# Altium schematic sheet POWER.SchDoc: Air724UG 参考设计
size 594 x 419 mm; DESIGNER: Loukanghua; REV: V1.0
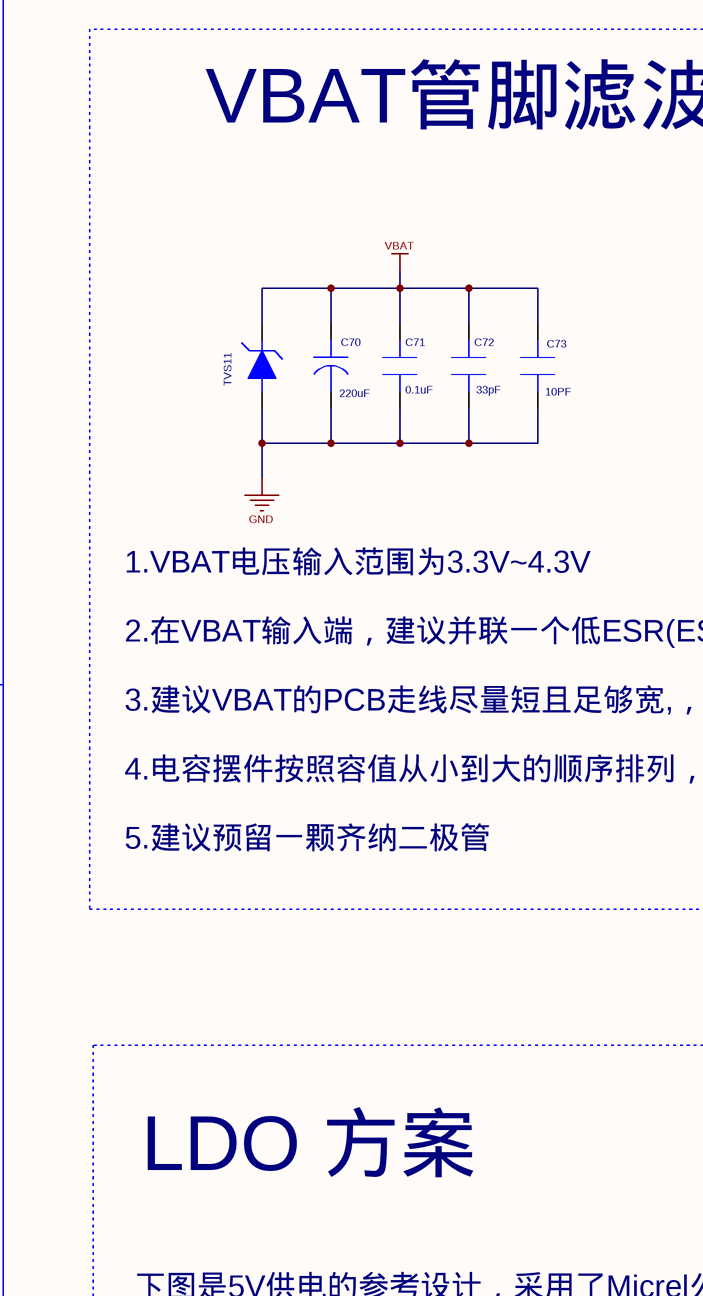
[diagram p0: POWER.SchDoc, top left]
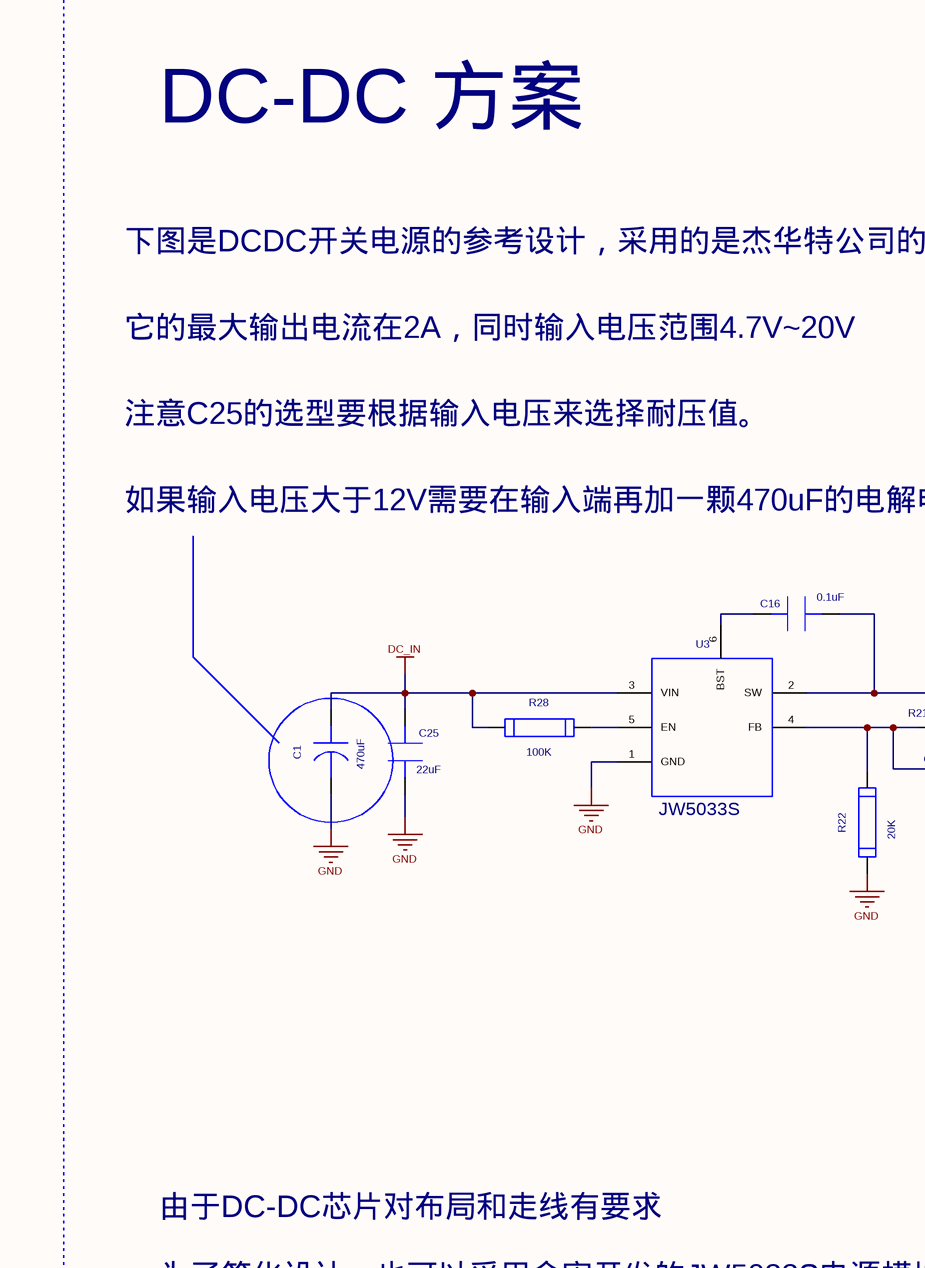
[diagram p1: POWER.SchDoc, top middle]
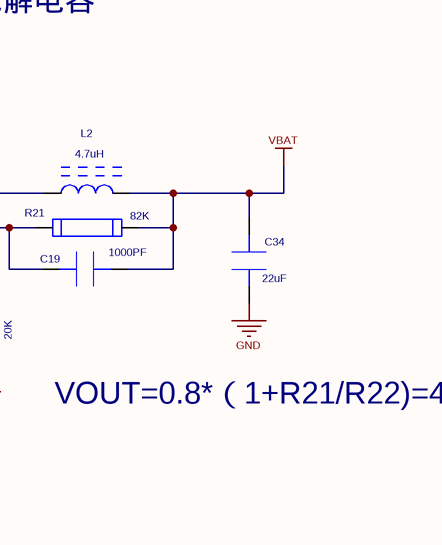
[diagram p2: POWER.SchDoc, top right]
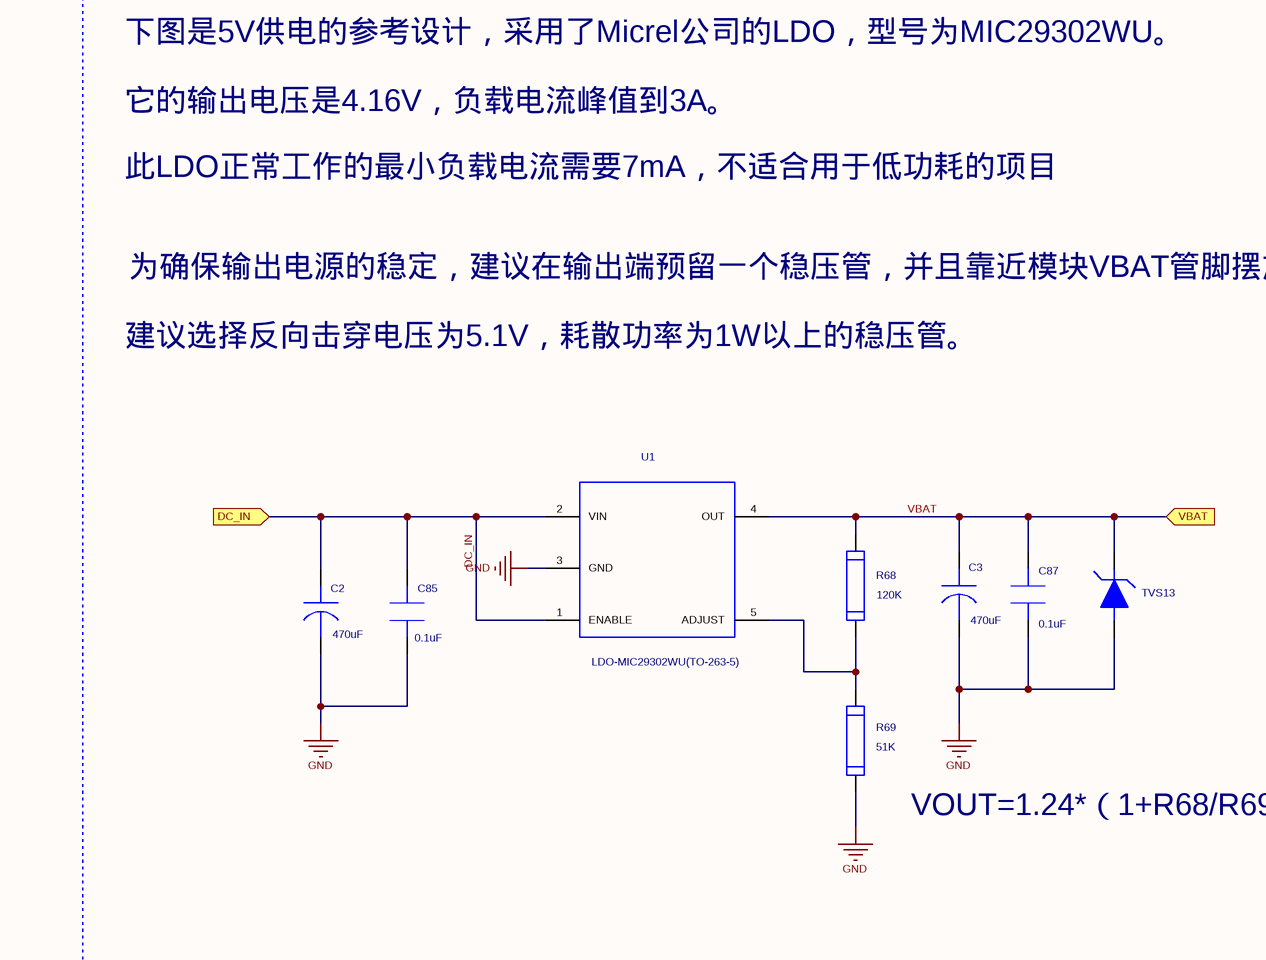
[diagram p3: POWER.SchDoc, bottom left]
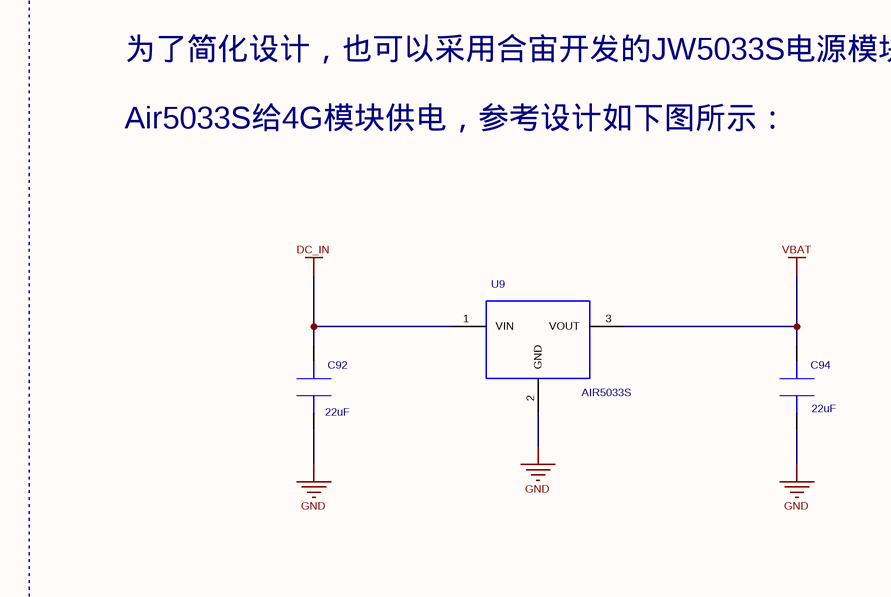
[diagram p4: POWER.SchDoc, bottom middle]
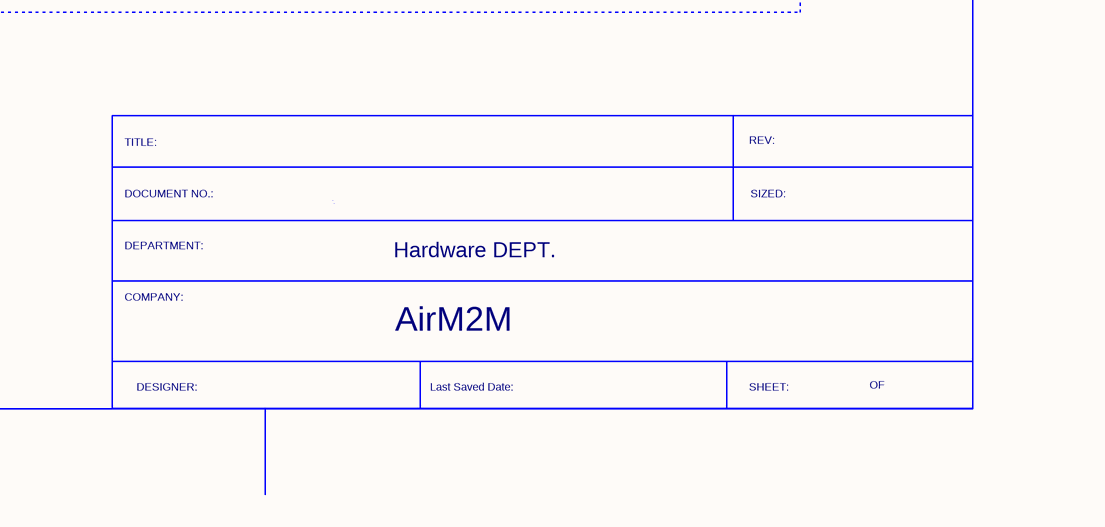
[diagram p5: POWER.SchDoc, bottom right]

## Parts
C1  value 470uF  [CAP-PD-8MMX11.5MM-UVR1C471MPD]  (hidden comment: CAP-AL-470UF-16V-8X11.5MM)
C2  value 470uF  [CAP-PD-8MMX11.5MM-UVR1C471MPD]  (hidden comment: CAP-AL-470UF-16V-8X11.5MM)
C3  value 470uF  [CAP-PD-8MMX11.5MM-UVR1C471MPD]  (hidden comment: CAP-AL-470UF-16V-8X11.5MM)
C16  value 0.1uF  [SC0402]  (hidden comment: CAP-0.1UF-0402-X5R-10V)
C19  value 1000PF  [SC0402]  (hidden comment: CAP-1000PF-0402-X7R)
C25  value 22uF  [SC0603]  (hidden comment: CAP-22UF-0603-X5R)
C34  value 22uF  [SC0603]  (hidden comment: CAP-4.7UF-0603-X5R)
C70  value 220uF  [CASEB]  (hidden comment: CAP-TAN-100UF-CASEB)
C71  value 0.1uF  [SC0402]  (hidden comment: CAP-0.1UF-0402-X7R)
C72  value 33pF  [SC0402]  (hidden comment: CAP-33PF-0402-C0G)
C73  value 10PF  [SC0402]  (hidden comment: CAP-10PF-0402-C0G)
C85  value 0.1uF  [SC0402]  (hidden comment: CAP-0.1UF-0402-X7R)
C87  value 0.1uF  [SC0402]  (hidden comment: CAP-0.1UF-0402-X7R)
C92  value 22uF  [SC0805]  (hidden comment: CAP-22UF-0805-X5R)
C94  value 22uF  [SC0805]  (hidden comment: CAP-22UF-0805-X5R)
L2  value 4.7uH  [MRSC252A12-4R7W-N]  (hidden comment: MRSC252A12-4R7W-N)
R21  value 82K  [SR0402]  (hidden comment: RES-82K-+-1%-0402)
R22  value 20K  [SR0402]  (hidden comment: RES-20K-+/-1%-0402)
R28  value 100K  [SR0402]  (hidden comment: RES-100K-0402)
R68  value 120K  [SR0402]  (hidden comment: RES-120K-+-1%-0402)
R69  value 51K  [SR0402]  (hidden comment: RES-51K-0402)
TVS11  ESD-TVS-PESDU4581P1H  [DFN1006]  (value not drawn)
TVS13  ESD-TVS-PESDU4581P1H  [DFN1006]  (value not drawn)
U1  LDO-MIC29302WU(TO-263-5)  [TO-263-5L]
U3  JW5033H  [JW5033S]  (value not drawn)
U9  AIR5033S  [A5033S]

## Blocks framed on the sheet
VBAT管脚滤波电容: C70-C73 TVS11
DC-DC 方案: C1 C16 C19 C25 C34 C92 C94 L2 R21 R22 R28 U3 U9
LDO 方案: C2 C3 C85 C87 R68 R69 TVS13 U1

## Ports
DC_IN, VBAT

## Nets
DC_IN: C1.1 C2.1 C25.2 C85.1 C92.2 R28.1 U1.1(ENABLE) U1.2(VIN) U3.3(VIN) U9.1(VIN) ; port DC_IN
GND: C1.2 C2.2 C3.2 C25.1 C34.1 C70.2 C71.2 C72.2 C73.2 C85.2 C87.2 C92.1 C94.1 R22.1 R69.1 TVS11.2 TVS13.2 U1.3(GND) U1.6(GND) U3.1(GND) U9.2(GND)
VBAT: C3.1 C19.2 C34.2 C70.1 C71.1 C72.1 C73.1 C87.1 C94.2 L2.2 R21.2 R68.2 TVS11.1 TVS13.1 U1.4(OUT) U9.3(VOUT) ; port VBAT
NetC16_1: C16.1 U3.6(BST)
NetC16_2: C16.2 L2.1 U3.2(SW)
NetC19_1: C19.1 R21.1 R22.2 U3.4(FB)
NetR28_2: R28.2 U3.5(EN)
NetR68_1: R68.1 R69.2 U1.5(ADJUST)

## Notes on the sheet
- 下图是DCDC开关电源的参考设计，采用的是杰华特公司的JW5033S 开关电源芯片
- 它的最大输出电流在2A，同时输入电压范围4.7V~20V
- 注意C25的选型要根据输入电压来选择耐压值。
- 1.VBAT电压输入范围为3.3V~4.3V
- 如果输入电压大于12V需要在输入端再加一颗470uF的电解电容
- 2.在VBAT输入端，建议并联一个低ESR(ESR=0.7Ω)的220uF的钽电容，以及100nF、33pF、10pF滤波电容
- 3.建议VBAT的PCB走线尽量短且足够宽,，宽度不少于1.2mm
- 4.电容摆件按照容值从小到大的顺序排列，所有电容都要靠近VBAT引脚放置。
- 5.建议预留一颗齐纳二极管
- (near U3) JW5033S
- VOUT=0.8*（1+R21/R22)=4.08V
- 由于DC-DC芯片对布局和走线有要求
- 下图是5V供电的参考设计，采用了Micrel公司的LDO，型号为MIC29302WU。
- 为了简化设计，也可以采用合宙开发的JW5033S电源模块：
- 它的输出电压是4.16V，负载电流峰值到3A。
- 此LDO正常工作的最小负载电流需要7mA，不适合用于低功耗的项目
- Air5033S给4G模块供电，参考设计如下图所示：
- 建议选择反向击穿电压为5.1V，耗散功率为1W以上的稳压管。
- 为确保输出电源的稳定，建议在输出端预留一个稳压管，并且靠近模块VBAT管脚摆放。
- (near R69) VOUT=1.24*（1+R68/R69)=4.16V
- TITLE:
- REV:
- DEPARTMENT:
- DOCUMENT NO.:
- Hardware DEPT.
- SIZED:
- COMPANY:
- AirM2M
- DESIGNER:
- Last Saved Date:
- SHEET:
- OF

## Library data of the parts
C1-C3 = CAP-AL-470UF-16V-8X11.5MM: 铝电解电容器;470uF;+/-20%;16V;8x11.5mm;引脚间距3.5mm;ROHS; Manufacture 1: NICHICON; Manufacture 1 P/N: UVR1C471MPD; Geometry.Height: 11.5mm; Serial Number: 80200830001; Tolerance: +/-20%; PCB DECAL: CAP-PD-8MMX11.5MM-UVR1C471MPD
C16 = CAP-0.1UF-0402-X5R-10V: CAP CER X5R/X7R;0.1uF;+/-10%;10V;0402;0.5mm;ROHS; Manufacture 1: Murata;Yageo;Walsin;Eyang; Manufacture 1 P/N: GRM155R61A104K****;GRM155R71A104K****;CC0402KRX5R6BB104;0402X104K100CT;C0402X5R104K100N*; Geometry.Height: 0.55mm; Serial Number: 80214720001; Tolerance: +/-10%; PCB DECAL: SC0402
C19 = CAP-1000PF-0402-X7R: CAP CER X7R;1000PF;+/-10%;50V;0402;0.5mm;ROHS; Manufacture 1 P/N: GRM155R71H102K****;CC0402KRX7R9BB102;0402B102K500CT;C0402X7R102K500N*; Manufacture 1: MURATA;Yageo;Walsin;Eyang; Geometry.Height: 0.55mm; Serial Number: 80214750001; Tolerance: +/-10%; PCB DECAL: SC0402
C25 = CAP-22UF-0603-X5R: CAP CER X5R;22uF;+/-20%;6.3V;0603;0.8mm;ROHS; Geometry.Height: 0.95mm; Tolerance: +/-20%; PCB DECAL: SC0603
C34 = CAP-4.7UF-0603-X5R: CAP CER X5R;4.7uF;+/-10%;6.3V;0603;0.8mm;ROHS; Manufacture 1: Murata;TDK;Yageo;Taiyo Yuden;Panasonic;Kyocera;Samsung;; Manufacture 1 P/N: GRM188R60J475K****;C1608X5R0J475K;CC0603KRX5R5BB475;JMK107BJ475KA-T;ECJ1VB0J475K;CV105X5R475K06ATCL10A475KQ8NNNC;; Geometry.Height: 0.95mm; Serial Number: 80216710002; Tolerance: +/-10%; PCB DECAL: SC0603
C70 = CAP-TAN-100UF-CASEB: CAP TAN;220uF;+/-20%;6.3V;CASEB;3.5*2.8*2.1mm;ROHS; Manufacture 1: Nichicon; Manufacture 1 P/N: F930J227MBA; Geometry.Height: 2.1mm; Serial Number: 80233810003; Tolerance: +/-20%; PCB DECAL: CASEB
C71 C85 C87 = CAP-0.1UF-0402-X7R: CAP CER X7R;0.1uF;+/-10%;16V;0402;0.5mm;ROHS; Manufacture 1: MURATA;Walsin;Yageo;Eyang;; Manufacture 1 P/N: GRM155R71C104K****;0402X104K160CT;CC0402KRX7R7BB104;C0402X5R104K160N*; Geometry.Height: 0.55mm; Serial Number: 80214730006; Tolerance: +/-10%; PCB DECAL: SC0402
C72 = CAP-33PF-0402-C0G: CAP CER C0G;33PF;+/-5%;50V;0402;0.5mm;ROHS; Manufacture 1: MURATA;Yageo;Eyang; Manufacture 1 P/N: GRM1555C1H330J****;CC0402JRNPO9BN330;C0402C0G330J500N*; Geometry.Height: 0.55mm; Serial Number: 80214650008; Tolerance: +/-5%; PCB DECAL: SC0402
C73 = CAP-10PF-0402-C0G: CAP CER C0G;10PF;+/-5%;50V;0402;0.5mm;ROHS; Manufacture 1: MURATA;TDK;Walsin;Yageo; Manufacture 1 P/N: GRM1555C1H100J****;C1005C0G1H100D;0402N100J500CT;CC0402JRNPO9BN100; Geometry.Height: 0.55mm; Serial Number: 80214650001; Tolerance: +/-5%; PCB DECAL: SC0402
C92 = CAP-22UF-0805-X5R: CAP CER X5R;22uF;20%;6.3V;0805;1.25mm;ROHS; Manufacture 1: Murata;Panasonic;TDK;Eyang;Taiyo Yuden;Samsung;Kyocera;; Manufacture 1 P/N: GRM21BR60J226M****;ECJ2FB0J226M;C2012JB0J226M;C0805X5R226M6R3NTM;JMK212BJ226MG-T;CL21A226MQQNNNE;CV21X5R226M06AT;; Geometry.Height: 1.55mm; Serial Number: 80218810001; Tolerance: 20%; PCB DECAL: SC0805
C94 = CAP-22UF-0805-X5R: CAP CER X5R;22uF;20%;6.3V;0805;1.25mm;ROHS; Manufacture 1: Murata;Panasonic;TDK;Eyang;Taiyo Yuden;Samsung;Kyocera;; Manufacture 1 P/N: GRM21BR60J226M****;ECJ2FB0J226M;C2012JB0J226M;C0805X5R226M6R3NTM;JMK212BJ226MG-T;CL21A226MQQNNNE;CV21X5R226M06AT;; Geometry.Height: 1.55mm; Serial Number: 80218810001; Priority: 1; Tolerance: 20%; PCB DECAL: SC0805; DataSheet: Z:\Datasheet\CAP\MURATA_GRM188R61A226ME15D.pdf; Update Time: 2015-12-14
L2 = MRSC252A12-4R7W-N: Manufacture 1: Chilisin(奇力新); Geometry.Height: 1.2 mm; PCB DECAL: MRSC252A12-4R7W-N
R21 = RES-82K-+-1%-0402: RES FILM;82K;+/-1%;1/16W;0402;0.4mm;ROHS; Manufacture 1: YAGEO; Manufacture 1 P/N: RC0402FR-0782KL; Serial Number: 80114440040; Geometry.Height: 0.4mm; Tolerance: +/-1%; PCB DECAL: SR0402
R22 = RES-20K-+/-1%-0402: RES FILM;20K;+/-1%;1/16W;0402;0.4mm;ROHS; Manufacture 1 P/N: RC0402FR-0720KL; Manufacture 1: YAGEO; Serial Number: 80114440008; Geometry.Height: 0.4mm; Tolerance: +/-1%; PCB DECAL: SR0402
R28 = RES-100K-0402: RES FILM;100K;+/-5%;1/16W;0402;0.4mm;ROHS; Manufacture 1: YAGEO;Walsin; Manufacture 1 P/N: RC0402JR-07100KL;WR04X104_JTL;; Geometry.Height: 0.40mm; Serial Number: 80114640005; Tolerance: +/-5%; PCB DECAL: SR0402
R68 = RES-120K-+-1%-0402: RES FILM;120K;+/-1%;1/16W;0402;0.4mm;ROHS; Manufacture 1 P/N: RC0402FR-07120KL; Manufacture 1: YAGEO; Tolerance: 1%; Serial Number: 80114440124; Geometry.Height: 0.40mm; PCB DECAL: SR0402
R69 = RES-51K-0402: RES FILM;51K;+/-5%;1/16W;0402;0.4mm;ROHS; Manufacture 1 P/N: RC0402JR-0751KL; Manufacture 1: YAGEO; Serial Number: 80114640015; Tolerance: +/-5%; Geometry.Height: 0.4mm; PCB DECAL: SR0402
TVS11 TVS13 = ESD-TVS-PESDU4581P1H: TVS；4.5V；双向；400W；DFN1006-2;1*0.6*0.5mm;ROHS; Manufacture 1: 智晶; Serial Number: 920190520185119; Geometry.Height: 0.4mm; Manufacture 1 P/N: PESDU4581P1H; PCB DECAL: DFN1006
U1 = LDO-MIC29302WU(TO-263-5): LDO;Adjustable;3A;TO-263-5;4.5mm;ROHS; Manufacturer: Micrel;; Geometry.Height: 4.7mm; Manufacture P/N: MIC29302WU; PCB DECAL: TO-263-5L
U3 = JW5033H: Geometry.Height: 1.1mm; PCB DECAL: JW5033S
U9 = AIR5033S: PCB DECAL: A5033S